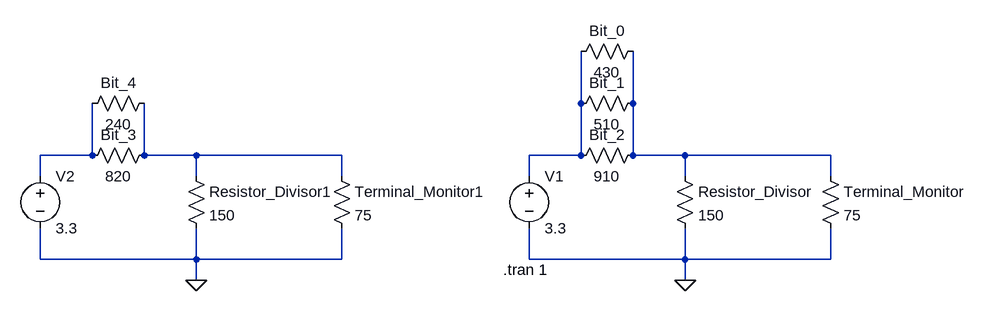
[diagram p0: schematic VGA.asc]
VGA.asc, the LTspice schematic file:
Version 4.1
SHEET 1 880 680
WIRE 128 -32 128 -112
WIRE 208 -32 208 -112
WIRE -624 48 -624 -32
WIRE -624 48 -704 48
WIRE -544 48 -544 -32
WIRE -464 48 -544 48
WIRE -240 48 -464 48
WIRE 128 48 128 -32
WIRE 128 48 48 48
WIRE 208 48 208 -32
WIRE 288 48 208 48
WIRE 512 48 288 48
WIRE -704 80 -704 48
WIRE -464 80 -464 48
WIRE -240 80 -240 48
WIRE 48 80 48 48
WIRE 288 80 288 48
WIRE 512 80 512 48
WIRE -704 208 -704 160
WIRE -464 208 -464 160
WIRE -464 208 -704 208
WIRE -240 208 -240 160
WIRE -240 208 -464 208
WIRE 48 208 48 160
WIRE 288 208 288 160
WIRE 288 208 48 208
WIRE 512 208 512 160
WIRE 512 208 288 208
WIRE -464 240 -464 208
WIRE 288 240 288 208
FLAG 288 240 0
FLAG -464 240 0
SYMBOL voltage 48 64 R0
WINDOW 123 0 0 Left 0
WINDOW 39 0 0 Left 0
SYMATTR InstName V1
SYMATTR Value 3.3
SYMBOL res 224 32 R90
WINDOW 0 0 56 VBottom 2
WINDOW 3 32 56 VTop 2
SYMATTR InstName Bit_2
SYMATTR Value 910
SYMBOL res 224 -48 R90
WINDOW 0 0 56 VBottom 2
WINDOW 3 32 56 VTop 2
SYMATTR InstName Bit_1
SYMATTR Value 510
SYMBOL res 224 -128 R90
WINDOW 0 0 56 VBottom 2
WINDOW 3 32 56 VTop 2
SYMATTR InstName Bit_0
SYMATTR Value 430
SYMBOL res 272 64 R0
SYMATTR InstName Resistor_Divisor
SYMATTR Value 150
SYMBOL res 496 64 R0
SYMATTR InstName Terminal_Monitor
SYMATTR Value 75
SYMBOL voltage -704 64 R0
WINDOW 123 0 0 Left 0
WINDOW 39 0 0 Left 0
SYMATTR InstName V2
SYMATTR Value 3.3
SYMBOL res -528 32 R90
WINDOW 0 0 56 VBottom 2
WINDOW 3 32 56 VTop 2
SYMATTR InstName Bit_3
SYMATTR Value 820
SYMBOL res -528 -48 R90
WINDOW 0 0 56 VBottom 2
WINDOW 3 32 56 VTop 2
SYMATTR InstName Bit_4
SYMATTR Value 240
SYMBOL res -480 64 R0
SYMATTR InstName Resistor_Divisor1
SYMATTR Value 150
SYMBOL res -256 64 R0
SYMATTR InstName Terminal_Monitor1
SYMATTR Value 75
TEXT 8 224 Left 2 !.tran 1

The netlist it stands for:
* VGA.asc
V1 N001 0 3.3
R§Bit_2 N002 N001 910
R§Bit_1 N002 N001 510
R§Bit_0 N002 N001 430
Resistor_Divisor N002 0 150
R§Terminal_Monitor N002 0 75
V2 N003 0 3.3
R§Bit_3 N004 N003 820
R§Bit_4 N004 N003 240
Resistor_Divisor1 N004 0 150
R§Terminal_Monitor1 N004 0 75
.tran 1
.backanno
.end